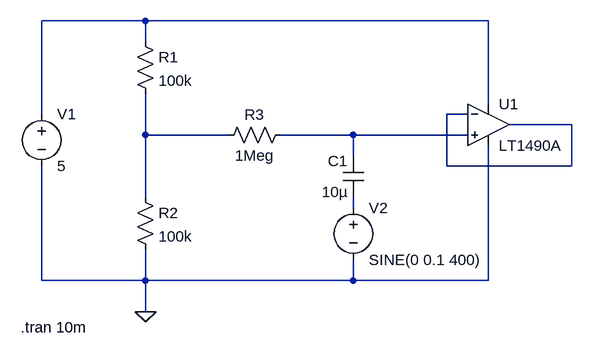
[diagram p0: schematic vbias_and_input_buffer.asc]
vbias_and_input_buffer.asc, the LTspice schematic file:
Version 4.1
SHEET 1 1288 680
WIRE 160 -128 0 -128
WIRE 688 -128 160 -128
WIRE 160 -96 160 -128
WIRE 688 0 688 -128
WIRE 0 16 0 -128
WIRE 656 16 624 16
WIRE 816 32 720 32
WIRE 160 48 160 -16
WIRE 288 48 160 48
WIRE 480 48 368 48
WIRE 656 48 480 48
WIRE 480 80 480 48
WIRE 624 96 624 16
WIRE 816 96 816 32
WIRE 816 96 624 96
WIRE 160 144 160 48
WIRE 480 160 480 144
WIRE 0 272 0 96
WIRE 160 272 160 224
WIRE 160 272 0 272
WIRE 480 272 480 240
WIRE 480 272 160 272
WIRE 688 272 688 64
WIRE 688 272 480 272
WIRE 160 320 160 272
FLAG 160 320 0
SYMBOL voltage 0 0 R0
WINDOW 123 0 0 Left 0
WINDOW 39 0 0 Left 0
SYMATTR InstName V1
SYMATTR Value 5
SYMBOL voltage 480 144 R0
WINDOW 123 0 0 Left 0
WINDOW 39 0 0 Left 0
SYMATTR InstName V2
SYMATTR Value SINE(0 0.1 400)
SYMBOL res 144 -112 R0
SYMATTR InstName R1
SYMATTR Value 100k
SYMBOL res 144 128 R0
SYMATTR InstName R2
SYMATTR Value 100k
SYMBOL res 272 64 R270
WINDOW 0 32 56 VTop 2
WINDOW 3 0 56 VBottom 2
SYMATTR InstName R3
SYMATTR Value 1Meg
SYMBOL cap 496 144 R180
WINDOW 0 24 56 Left 2
WINDOW 3 24 8 Left 2
SYMATTR InstName C1
SYMATTR Value 10µ
SYMBOL OpAmps\\LT1490A 688 -32 R0
SYMATTR InstName U1
TEXT -32 344 Left 2 !.tran 10m

The netlist it stands for:
* vbias_and_input_buffer.asc
V1 N001 0 5
V2 N005 0 SINE(0 0.1 400)
R1 N001 N003 100k
R2 N003 0 100k
R3 N003 N004 1Meg
C1 N005 N004 10µ
X§U1 N004 N002 N001 0 N002 LT1490A  ; pins In+ In- V+ V- OUT
.tran 10m
.backanno
.end